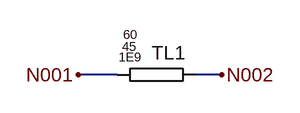
[diagram p0: schematic LineaTranmisionSerie.asc]
LineaTranmisionSerie.asc, the LTspice schematic file:
Version 4
SHEET 1 880 680
WIRE -160 16 -208 16
WIRE -32 16 -64 16
FLAG -208 16 N001
FLAG -32 16 N002
SYMBOL TL -112 16 R0
SYMATTR SpiceModel 60
SYMATTR Value 45
SYMATTR Value2 1E9
SYMATTR InstName TL1

The netlist it stands for:
* LineaTranmisionSerie.asc
TL1 N001 N002 60 45 1E9
.backanno
.end